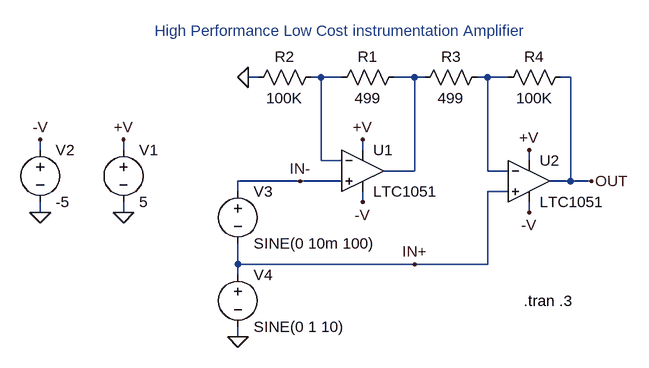
[diagram p0: schematic 1051.asc]
1051.asc, the LTspice schematic file:
Version 4
SHEET 1 896 680
WIRE 32 96 16 96
WIRE 128 96 112 96
WIRE 160 96 128 96
WIRE 272 96 240 96
WIRE 288 96 272 96
WIRE 384 96 368 96
WIRE 416 96 384 96
WIRE 512 96 496 96
WIRE -304 208 -304 192
WIRE -176 208 -176 192
WIRE 192 208 192 192
WIRE 128 224 128 96
WIRE 160 224 128 224
WIRE 448 224 448 208
WIRE 272 240 272 96
WIRE 272 240 224 240
WIRE 384 240 384 96
WIRE 416 240 384 240
WIRE 96 256 0 256
WIRE 160 256 96 256
WIRE 512 256 512 96
WIRE 512 256 480 256
WIRE 544 256 512 256
WIRE 0 272 0 256
WIRE 416 272 384 272
WIRE 192 288 192 272
WIRE -304 304 -304 288
WIRE -176 304 -176 288
WIRE 448 304 448 288
WIRE 0 384 0 352
WIRE 272 384 0 384
WIRE 384 384 384 272
WIRE 384 384 272 384
WIRE 0 400 0 384
WIRE 0 496 0 480
FLAG -176 304 0
FLAG 192 192 +V
FLAG -176 192 +V
FLAG 192 288 -V
FLAG -304 304 0
FLAG -304 192 -V
FLAG 16 96 0
FLAG 0 496 0
FLAG 448 208 +V
FLAG 448 304 -V
FLAG 544 256 OUT
FLAG 96 256 IN-
FLAG 272 384 IN+
SYMBOL voltage -176 192 R0
SYMATTR InstName V1
SYMATTR Value 5
SYMBOL voltage -304 192 R0
SYMATTR InstName V2
SYMATTR Value -5
SYMBOL res 256 80 R90
WINDOW 0 0 56 VBottom 2
WINDOW 3 32 56 VTop 2
SYMATTR InstName R1
SYMATTR Value 499
SYMBOL res 128 80 R90
WINDOW 0 0 56 VBottom 2
WINDOW 3 32 56 VTop 2
SYMATTR InstName R2
SYMATTR Value 100K
SYMBOL voltage 0 256 R0
SYMATTR InstName V3
SYMATTR Value SINE(0 10m 100)
SYMBOL opamps\\LTC1051 192 176 R0
SYMATTR InstName U1
SYMBOL res 384 80 R90
WINDOW 0 0 56 VBottom 2
WINDOW 3 32 56 VTop 2
SYMATTR InstName R3
SYMATTR Value 499
SYMBOL res 512 80 R90
WINDOW 0 0 56 VBottom 2
WINDOW 3 32 56 VTop 2
SYMATTR InstName R4
SYMATTR Value 100K
SYMBOL opamps\\LTC1051 448 192 R0
SYMATTR InstName U2
SYMBOL voltage 0 384 R0
SYMATTR InstName V4
SYMATTR Value SINE(0 1 10)
TEXT 440 440 Left 2 !.tran .3
TEXT 160 40 Bottom 2 ;High Performance Low Cost instrumentation Amplifier

The netlist it stands for:
* 1051.asc
V1 +V 0 5
V2 -V 0 -5
R1 N002 N001 499
R2 N001 0 100K
V3 IN- IN+ SINE(0 10m 100)
XU1 IN- N001 +V -V N002 LTC1051  ; pins In+ In- V+ V- OUT
R3 N003 N002 499
R4 OUT N003 100K
XU2 IN+ N003 +V -V OUT LTC1051  ; pins In+ In- V+ V- OUT
V4 IN+ 0 SINE(0 1 10)
.tran .3
* High Performance Low Cost instrumentation Amplifier
.backanno
.end